# Altium schematic sheet ActiTouch_Shield_Sheet1.SchDoc
size A4; SheetNumber: 4; SheetTotal: 6
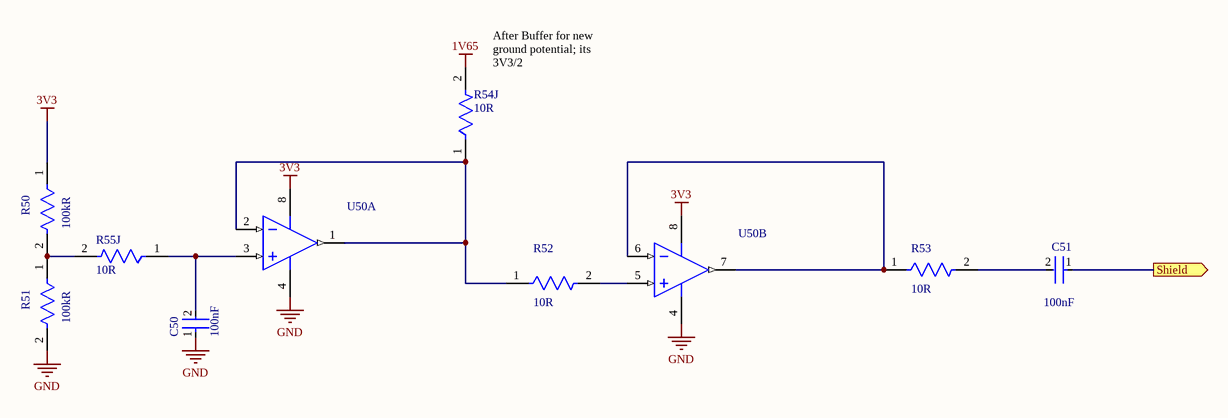
[diagram p0: ActiTouch_Shield_Sheet1.SchDoc]

## Parts
C50  Capacitance: 100nF  [FP-0603-L_1_6_0_1-W_0_8_0-IPC_B]  (hidden comment: EMK107B7104KAHT)
C51  Capacitance: 100nF  [FP-0603-L_1_6_0_1-W_0_8_0-IPC_B]  (hidden comment: EMK107B7104KAHT)
R50  Resistance: 100kR  [FP-RMCF0603-IPC_C]  (hidden comment: RMCF0603FT100K)
R51  Resistance: 100kR  [FP-RMCF0603-IPC_C]  (hidden comment: RMCF0603FT100K)
R52  Resistance: 10R  [FP-RNCP0603-MFG]  (hidden comment: RNCP0603FTD10R0)
R53  Resistance: 10R  [FP-RNCP0603-MFG]  (hidden comment: RNCP0603FTD10R0)
R54J  Resistance: 10R  [FP-RNCP0603-MFG]  (hidden comment: RNCP0603FTD10R0)
R55J  Resistance: 10R  [FP-RNCP0603-MFG]  (hidden comment: RNCP0603FTD10R0)
U50  OPA2836IDR  [D0008A_M]  (value not drawn)  (parts A,B of 2)

## Ports
Shield (out)

## Nets
1V65: R54J.2
3V3: R50.1 U50.8(VS+)
GND: C50.1 R51.2 U50.4(VS-)
Shield: C51.1 ; port Shield
NetC50_2: C50.2 R55J.1 U50.3(VIN1+)
NetC51_2: C51.2 R53.2
NetR50_2: R50.2 R51.1 R55J.2
NetR52_1: R52.1 R54J.1 U50.1(VOUT1) U50.2(VIN1-)
NetR52_2: R52.2 U50.5(VIN2+)
NetR53_1: R53.1 U50.6(VIN2-) U50.7(VOUT2)

## Notes on the sheet
- (near R54J) After Buffer for new ground potential; its 3V3/2

## Library data of the parts
C50 C51 = CMP-14477-003798-2: None; Voltage Rating (DC): 16V; Tolerance: 10%; Package Quantity: 4000; Packaging: Tape and Reel; Lead Free: Lead Free; Voltage Rating: 16V; Halogen Free: Halogen Free; Case/Package: 0603
R50 R51 = CMP-2000-06989-2: 100kΩ ±1% 0.1W 0603 Thick Film Chip Resistor AEC-Q200 compliant; Working Voltage: 75V; Max Power Dissipation: 100mW; Temperature Coefficient: 100ppm/°C; Height: 0.022inch; Construction: Rectangular; Lead Free: Lead Free; Tolerance: 1%; Features: Automotive AEC-Q200; Packaging: Tape and Reel; Number of Terminations: 2; Mount: Surface Mount; Case Code (Imperial): 0603; Case/Package: 0603; Resistor Type: Thick Film; Radiation Hardening: No; Power Rating: 100mW; Max Operating Temperature: 155°C; Length: 1.55mm; Width: 0.031inch; Military Standard: Not; RoHS Compliant: Yes; Min Operating Temperature: -55°C; Series: RMCF; Depth: 0.8mm; Case Code (Metric): 1608; Contact Plating: Tin
R52 R53 R54J R55J = CMP-26527-000751-1: 10Ω ±1% 0.125W 0603 High Power Anti-Sulfur Thin Film Chip Resistor; Temperature Coefficient: 100ppm/°C; Max Power Dissipation: 125mW; Case Code (Imperial): 0603; Case/Package: 0603; Tolerance: 1%; Features: Moisture Resistant; Width: 0.031inch; Series: RNCP; Lead Free: Lead Free; Max Operating Temperature: 155°C; Height: 0.02inch; Length: 0.059inch; Case Code (Metric): 1608; Min Operating Temperature: -55°C; Packaging: Tape and Reel; Resistor Type: Thin Film; RoHS Compliant: Yes; Mount: Surface Mount; Number of Terminations: 2
U50 = CMP-0018-00293-2: Dual, Very Low Power, Rail to Rail Out, Negative Rail In, VFB Operational Amplifier, 2.5 to 5.5 V, -40 to 85 degC, 8-pin SOIC (D8), Green (RoHS & no Sb/Br); Manufacturer: Texas Instruments; Settling Time (0.1%)(Typ)(ns): 30; Iib(Max)(nA): 1000; Vio(Max)(mV): 0.4; Vs(Min)(V): 2.5; Vs(Max)(V): 5.5; Io(Typ)(mA): 50; Sub Family: High Output Current Amplifier (>=50mA), High Speed Amplifier (>=50MHz), Low Noise Amp (<=10nV/rtHz), Low Offset Voltage Amplifier (<=500uV), Low Supply Voltage Amplifier (<=2.7V); Vn at Flatband(Typ)(nV/rtHz): 4.6; Slew Rate(Typ)(V/us): 560; Number of Channels: 2; Iq per channel(Max)(mA): 1; BW @ Acl(MHz): 205; 3rd Harmonic(dBc): 105; 2nd Harmonic(dBc): 85; Mounting Technology: Surface Mount; ComponentLink3URL: http://www.ti.com/litv/pdf/msoi002j; ComponentLink1URL: http://www.ti.com/; DatasheetVersion: SLOS712D; Code_JEDEC: MS-012; PackageDescription: 8-Pin Plastic Small Outline, Body 4.9 x 3.9 mm, Pitch 1.27 mm; ComponentLink3Description: Package Specification; Eco-Plan: Green (RoHS & no Sb/Br); PackageReference: D0008A; PackageVersion: 4040047-3/M, 06/2011; PartNumber: OPA2836IDR; ComponentLink2Description: Datasheet; Acl, min stable gain(V/V): 1; ComponentLink1Description: Manufacturer URL; ComponentLink2URL: http://www.ti.com/general/docs/lit/getliterature.tsp?genericPartNumber=OPA2836&fileType=pdf